# EAGLE schematic PowerMeasuringIC (EAGLE 7.5.0)
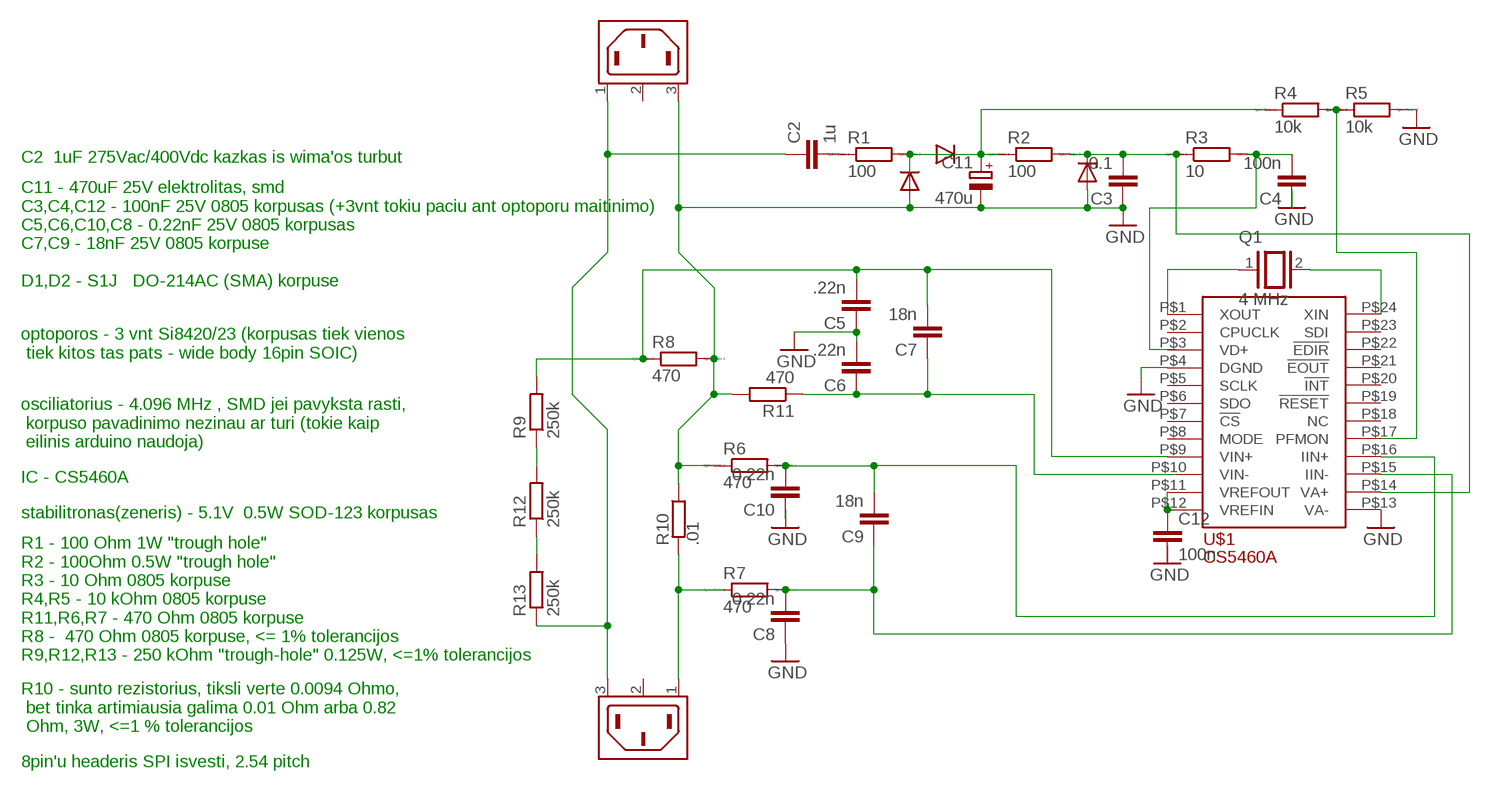
[diagram p0: schematic, sheet 1]

## Parts
C2  1u  C-EUC1206  [C1206]
C3  0.1  C-EUC1206  [C1206]
C4  100n  C-EUC1206  [C1206]
C5  .22n  C-EUC1206  [C1206]
C6  .22n  C-EUC1206  [C1206]
C7  18n  C-EUC1206  [C1206]
C8  0.22n  C-EUC1206  [C1206]
C9  18n  C-EUC1206  [C1206]
C10  0.22n  C-EUC1206  [C1206]
C11  470u  CPOL-EU153CLV-0807  [153CLV-0807]
C12  100n  C-EU025-024X044  [C025-024X044]
Q1  4 MHz  XTAL  [Q]
R1  100  RR4527  [R4527]
R2  100  RR4527  [R4527]
R3  10  RR4527  [R4527]
R4  10k  RR4527  [R4527]
R5  10k  RR4527  [R4527]
R6  470  RR4527  [R4527]
R7  470  RR4527  [R4527]
R8  470  RR4527  [R4527]
R9  250k  R-EU_0204/5  [0204/5]
R10  .01  SMT-WAV  [SMT-WAV]
R11  470  R-EU_0207/7  [0207/7]
R12  250k  R-EU_0204/5  [0204/5]
R13  250k  R-EU_0204/5  [0204/5]
U$1  CS4560ASSOP24  [SSOP24]
X1  6ESRM-P  [6ESRM-P]
X2  6ESRM-P  [6ESRM-P]

## Nets
GND: C3.1 C4.1 C5.1 C6.2 C8.1 C10.1 C11.- C12.2 R5.2 R6.1 R8.2 R10.1 R11.2 U$1.P$4(DGND) U$1.P$13(VA-) X1.3(AC2)
N$1: C8.2 C9.1 R7.2 U$1.P$15(IIN-)
N$2: C2.2 R1.1
N$3: C11.+ R1.2 R2.1 R4.1
N$4: C9.2 C10.2 R6.2 U$1.P$16(IIN+)
N$5: R4.2 R5.1 U$1.P$17(PFMON)
N$6: C3.2 R2.2 R3.1 U$1.P$14(VA+)
N$7: C4.2 R3.2
N$8: C5.2 C7.2 R8.1 R9.2 U$1.P$9(VIN+)
N$9: R10.2 X2.1(AC1)
N$10: C2.1 R13.1 X1.1(AC1) X2.3(AC2)
N$11: C12.1 U$1.P$11(VREFOUT) U$1.P$12(VREFIN)
N$12: C6.1 C7.1 R11.1
N$13: Q1.1 U$1.P$1(XOUT)
N$15: Q1.2 U$1.P$24(XIN)
N$16: R9.1 R12.2
N$17: R12.1 R13.2
Unconnected: R7.1 U$1.P$2(CPUCLK) U$1.P$3(VD+) U$1.P$5(SCLK) U$1.P$6(SDO) U$1.P$7(!CS!) U$1.P$8(MODE) U$1.P$10(VIN-) U$1.P$18(NC) U$1.P$19(!RESET!) U$1.P$20(!INT!) U$1.P$21(!EOUT!) U$1.P$22(!EDIR!) U$1.P$23(SDI) X1.2(SH) X2.2(SH)

## Notes on the sheet
- C2  1uF 275Vac/400Vdc kazkas is wima'os turbut
- C11 - 470uF 25V elektrolitas, smd
  C3,C4,C12 - 100nF 25V 0805 korpusas (+3vnt tokiu paciu ant optoporu maitinimo)
  C5,C6,C10,C8 - 0.22nF 25V 0805 korpusas
  C7,C9 - 18nF 25V 0805 korpuse
  
  D1,D2 - S1J   DO-214AC (SMA) korpuse
- optoporos - 3 vnt Si8420/23 (korpusas tiek vienos
   tiek kitos tas pats - wide body 16pin SOIC)
- osciliatorius - 4.096 MHz , SMD jei pavyksta rasti,
   korpuso pavadinimo nezinau ar turi (tokie kaip
   eilinis arduino naudoja)
- IC - CS5460A
- stabilitronas(zeneris) - 5.1V  0.5W SOD-123 korpusas
- R1 - 100 Ohm 1W "trough hole"
  R2 - 100Ohm 0.5W "trough hole"
  R3 - 10 Ohm 0805 korpuse
  R4,R5 - 10 kOhm 0805 korpuse
  R11,R6,R7 - 470 Ohm 0805 korpuse
  R8 -  470 Ohm 0805 korpuse, <= 1% tolerancijos
  R9,R12,R13 - 250 kOhm "trough-hole" 0.125W, <=1% tolerancijos
- R10 - sunto rezistorius, tiksli verte 0.0094 Ohmo,
   bet tinka artimiausia galima 0.01 Ohm arba 0.82
   Ohm, 3W, <=1 % tolerancijos
- 8pin'u headeris SPI isvesti, 2.54 pitch

## Library data of the parts
C2-C10 C12 = rcl:C-EU: CAPACITOR, European symbol
C11 = rcl:CPOL-EU: POLARIZED CAPACITOR, European symbol
Q1 = special:XTAL: CRYSTAL
R1-R8 = eagle-ltspice:R: RESISTOR, European symbol; SPICEMODEL: NONE; SPICEPREFIX: R
R9 R11-R13 = resistor:R-EU_: RESISTOR, European symbol
R10 = resistor-shunt:SMT-WAV: SMD SHUNT RESISTOR; OC_FARNELL: unknown; OC_NEWARK: unknown
U$1 = CS4560:CS4560A
X1 X2 = con-tycoelectronics:6ESRM-P: AC Connector 120/250 VAC Source: http://catalog.tycoelectronics.com .. ENG_DS_1654001_1099_SR_0406.pdf; MF: TYCO ELECTRONICS; MPN: 6ESRM-P; OC_FARNELL: unknown; OC_NEWARK: 87F1821